# Altium schematic sheet norbi_lm_interface.SchDoc: Имя
size 209 x 297 mm; ApprovedBy: Утвердил; CheckedBy: Проверил; Author: Разработал; Organization: НГУ; DocumentNumber: Децимальный номер Э3; SheetNumber: Лист; SheetTotal: Листов; PageSetup: Record=PageOptions|CenterHorizontal=True|CenterVertical=True|PrintScale=1.00|XCorrection=1.00|YCorrection=1.00|PrintKind=1|BorderSize=5000000|LeftOffset=0|BottomOffset=0|Orientation=2|PaperLength=1000|PaperWidth=1000|Scale=100|PaperSource=15|PrintQuality=1200|MediaType=1|DitherType=10|PaperKind=A3|PrintScaleMode=1; Weight: -; ScaleFactor: -; NormInspection: Норм.Контр.
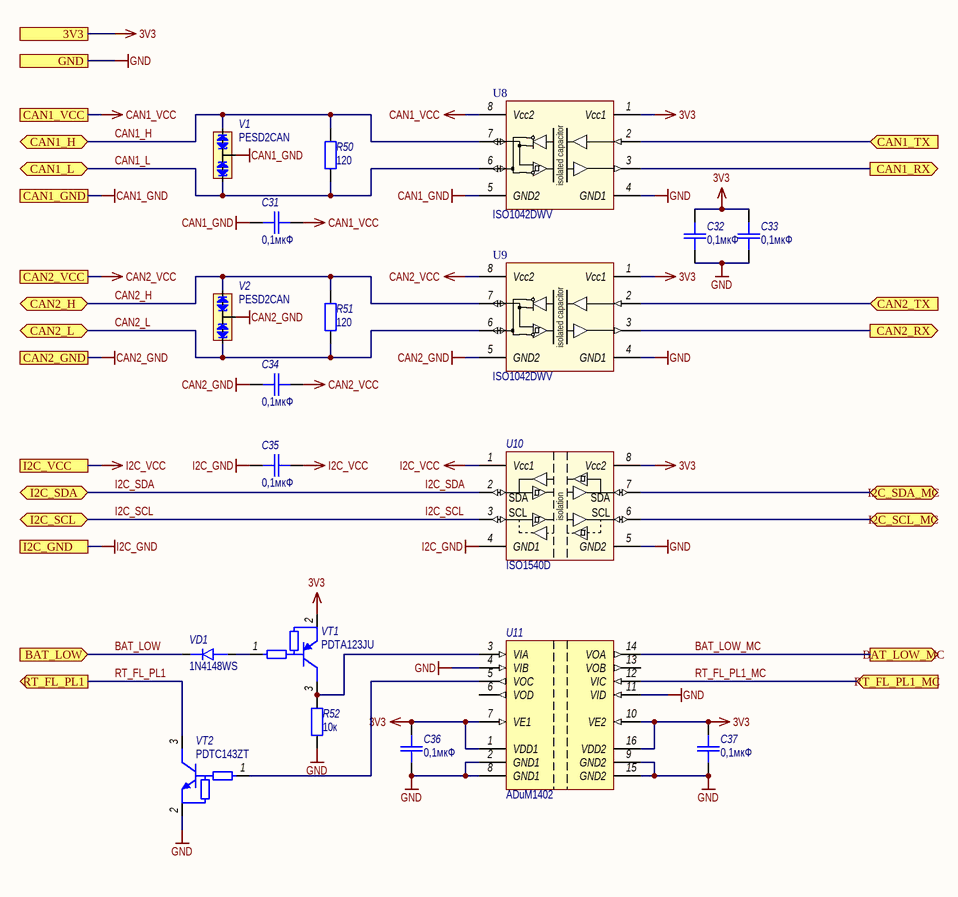
[diagram p0: norbi_lm_interface.SchDoc]

## Parts
C31  0,1мкФ  [CR-0603]
C32  0,1мкФ  [CR-0603]
C33  0,1мкФ  [CR-0603]
C34  0,1мкФ  [CR-0603]
C35  0,1мкФ  [CR-0603]
C36  0,1мкФ  [CR-0603]
C37  0,1мкФ  [CR-0603]
R50  120  [CR-0603]
R51  120  [CR-0603]
R52  10к  [CR-0603]
U8  Наименование: ISO1042DWV  [SOIC-8-WIDE]  (hidden comment: ISO1042)
U9  Наименование: ISO1042DWV  [SOIC-8-WIDE]  (hidden comment: ISO1042)
U10  Наименование: ISO1540D  [SOIC-8]  (hidden comment: ISO1540)
U11  ADuM1402  [SOIC-16-WIDE]
V1  PESD2CAN  [SOT-23]
V2  PESD2CAN  [SOT-23]
VD1  1N4148WS  [SOD-323]
VT1  PDTA123JU  [SOT-323 (SC-70)]
VT2  PDTC143ZT  [SOT-23]

## Ports
3V3, BAT_LOW (in), BAT_LOW_MC (out), CAN1_GND, CAN1_H (bidir), CAN1_L (bidir), CAN1_RX (out), CAN1_TX (in), CAN1_VCC, CAN2_GND, CAN2_H (bidir), CAN2_L (bidir), CAN2_RX (out), CAN2_TX (in), CAN2_VCC, GND, I2C_GND, I2C_SCL (bidir), I2C_SCL_MC (bidir), I2C_SDA (bidir), I2C_SDA_MC (bidir), I2C_VCC, RT_FL_PL1 (out), RT_FL_PL1_MC (in)

## Nets
3V3: C32.2 C33.2 C36.2 C37.2 U8.1(Vcc1) U9.1(Vcc1) U10.8(Vcc2) U11.1(VDD1) U11.7(VE1) U11.10(VE2) U11.16(VDD2) VT1.2(E) ; port 3V3
CAN1_GND: C31.1 U8.5(GND2) V1.3(CC) ; port CAN1_GND
CAN1_VCC: C31.2 U8.8(Vcc2) ; port CAN1_VCC
CAN2_GND: C34.1 U9.5(GND2) V2.3(CC) ; port CAN2_GND
CAN2_VCC: C34.2 U9.8(Vcc2) ; port CAN2_VCC
GND: C32.1 C33.1 C36.1 C37.1 R52.2 U8.4(GND1) U9.4(GND1) U10.5(GND2) U11.2(GND1) U11.4(VIB) U11.8(GND1) U11.9(GND2) U11.11(VID) U11.15(GND2) VT2.2(E) ; port GND
I2C_GND: C35.1 U10.4(GND1) ; port I2C_GND
I2C_VCC: C35.2 U10.1(Vcc1) ; port I2C_VCC
BAT_LOW: VD1.1(Cathode) ; port BAT_LOW
BAT_LOW_MC: U11.14(VOA) ; port BAT_LOW_MC
CAN1_H: R50.2 U8.7(CANH) V1.1(C1) ; port CAN1_H
CAN1_L: R50.1 U8.6(CANL) V1.2(C2) ; port CAN1_L
CAN1_RX: U8.3(RXD) ; port CAN1_RX
CAN1_TX: U8.2(TXD) ; port CAN1_TX
CAN2_H: R51.2 U9.7(CANH) V2.1(C1) ; port CAN2_H
CAN2_L: R51.1 U9.6(CANL) V2.2(C2) ; port CAN2_L
CAN2_RX: U9.3(RXD) ; port CAN2_RX
CAN2_TX: U9.2(TXD) ; port CAN2_TX
I2C_SCL: U10.3(SCL) ; port I2C_SCL
I2C_SCL_MC: U10.6(SCL) ; port I2C_SCL_MC
I2C_SDA: U10.2(SDA) ; port I2C_SDA
I2C_SDA_MC: U10.7(SDA) ; port I2C_SDA_MC
RT_FL_PL1: VT2.3(C) ; port RT_FL_PL1
RT_FL_PL1_MC: U11.12(VIC) ; port RT_FL_PL1_MC
NetR52_1: R52.1 U11.3(VIA) VT1.3(C)
NetU11_5: U11.5(VOC) VT2.1(B)
NetVD1_2: VD1.2(Anode) VT1.1(B)

Not connected (* = marked no-connect by the designer): U11 6(VOD) 13(VOB)

## Notes on the sheet
- Подп. и дата
- Инв. № дубл.
- Взам. инв. №
- Инв. № подл.
- Изм.
- Лист
- № докум.
- Подп.
- Дата
- Форма 2а ГОСТ 2.104-2006
- Копировал
- Формат А4
- (in symbol ISO154x) isolation
- (in symbol ISO1042) isolated capacitor

## Library data of the parts
C31-C37 = C_smd: Конденсатор для поверхностного монтажа; Назначение: Чип-конденсатор; Потребление, Вт: 0; Наименование: SMD-0603; Value: 0,1мкФ
R50 R51 = R_smd: Резистор для поверхностного монтажа; Наименование: SMD-0603 1%; Назначение: Чип-резистор; Потребление, Вт: 0,001; Value: 120
R52 = R_smd: Резистор для поверхностного монтажа; Наименование: SMD-0603 20%; Назначение: Чип-резистор; Потребление, Вт: 0,001; Value: 10к
U8 U9 = ISO1042: Isolated CAN Transceiver; Назначение: Изолированный CAN приемник; Потребление, Вт: 0,001
U10 = ISO154x: Low-Power Bidirectional I2C Isolators; Потребление, Вт: 0,001; Назначение: Low-Power Bidirectional I2C Isolators
U11 = ADuM1402: Quad Channel Digital Isolator, 2.5 KV rms Insulation Rating; Назначение: 4-канальный цифровой изолятор; Потребление, Вт: 0,025; Наименование: ADuM1402
V1 V2 = PESD2CAN: CAN bus ESD protection diode; Назначение: Защитная диодная сборка CAN-шины от ЭСР; Потребление, Вт: 0,001; Наименование: PESD2CAN
VD1 = BAT60A: Diod 150 mA 100V; Назначение: Диод 150мА 100В; Потребление, Вт: 0,001; Наименование: 1N4148WS
VT1 = PDTA123JU: Digital Transistor (resistor-equipped transistors), R1=R2=2k, PNP Transistor, 3-Pin SC-70; Назначение: Resistor-equipped transistors, R1=R2=2k, PNP Transistor, 3-Pin SC-70; Потребление, Вт: 0,001; ComponentLink1Description: Datasheet; ComponentLink1URL: https://assets.nexperia.com/documents/data-sheet/PDTC114E_SER.pdf; Наименование: PDTA123JU
VT2 = PDTC143ZT: Digital Transistor (BRT), R1=4.7 kOhm, R2=47 kOhm, NPN Transistor, 3-Pin; Потребление, Вт: 0,001; Назначение: Digital Transistor (BRT), R1=4.7 kOhm, R2=47 kOhm, NPN Transistor, 3-Pin; ComponentLink1Description: Datasheet; ComponentLink1URL: https://assets.nexperia.com/documents/data-sheet/PDTC114E_SER.pdf; Наименование: PDTC143ZT